# EAGLE design M060A (EAGLE 6.6.0)
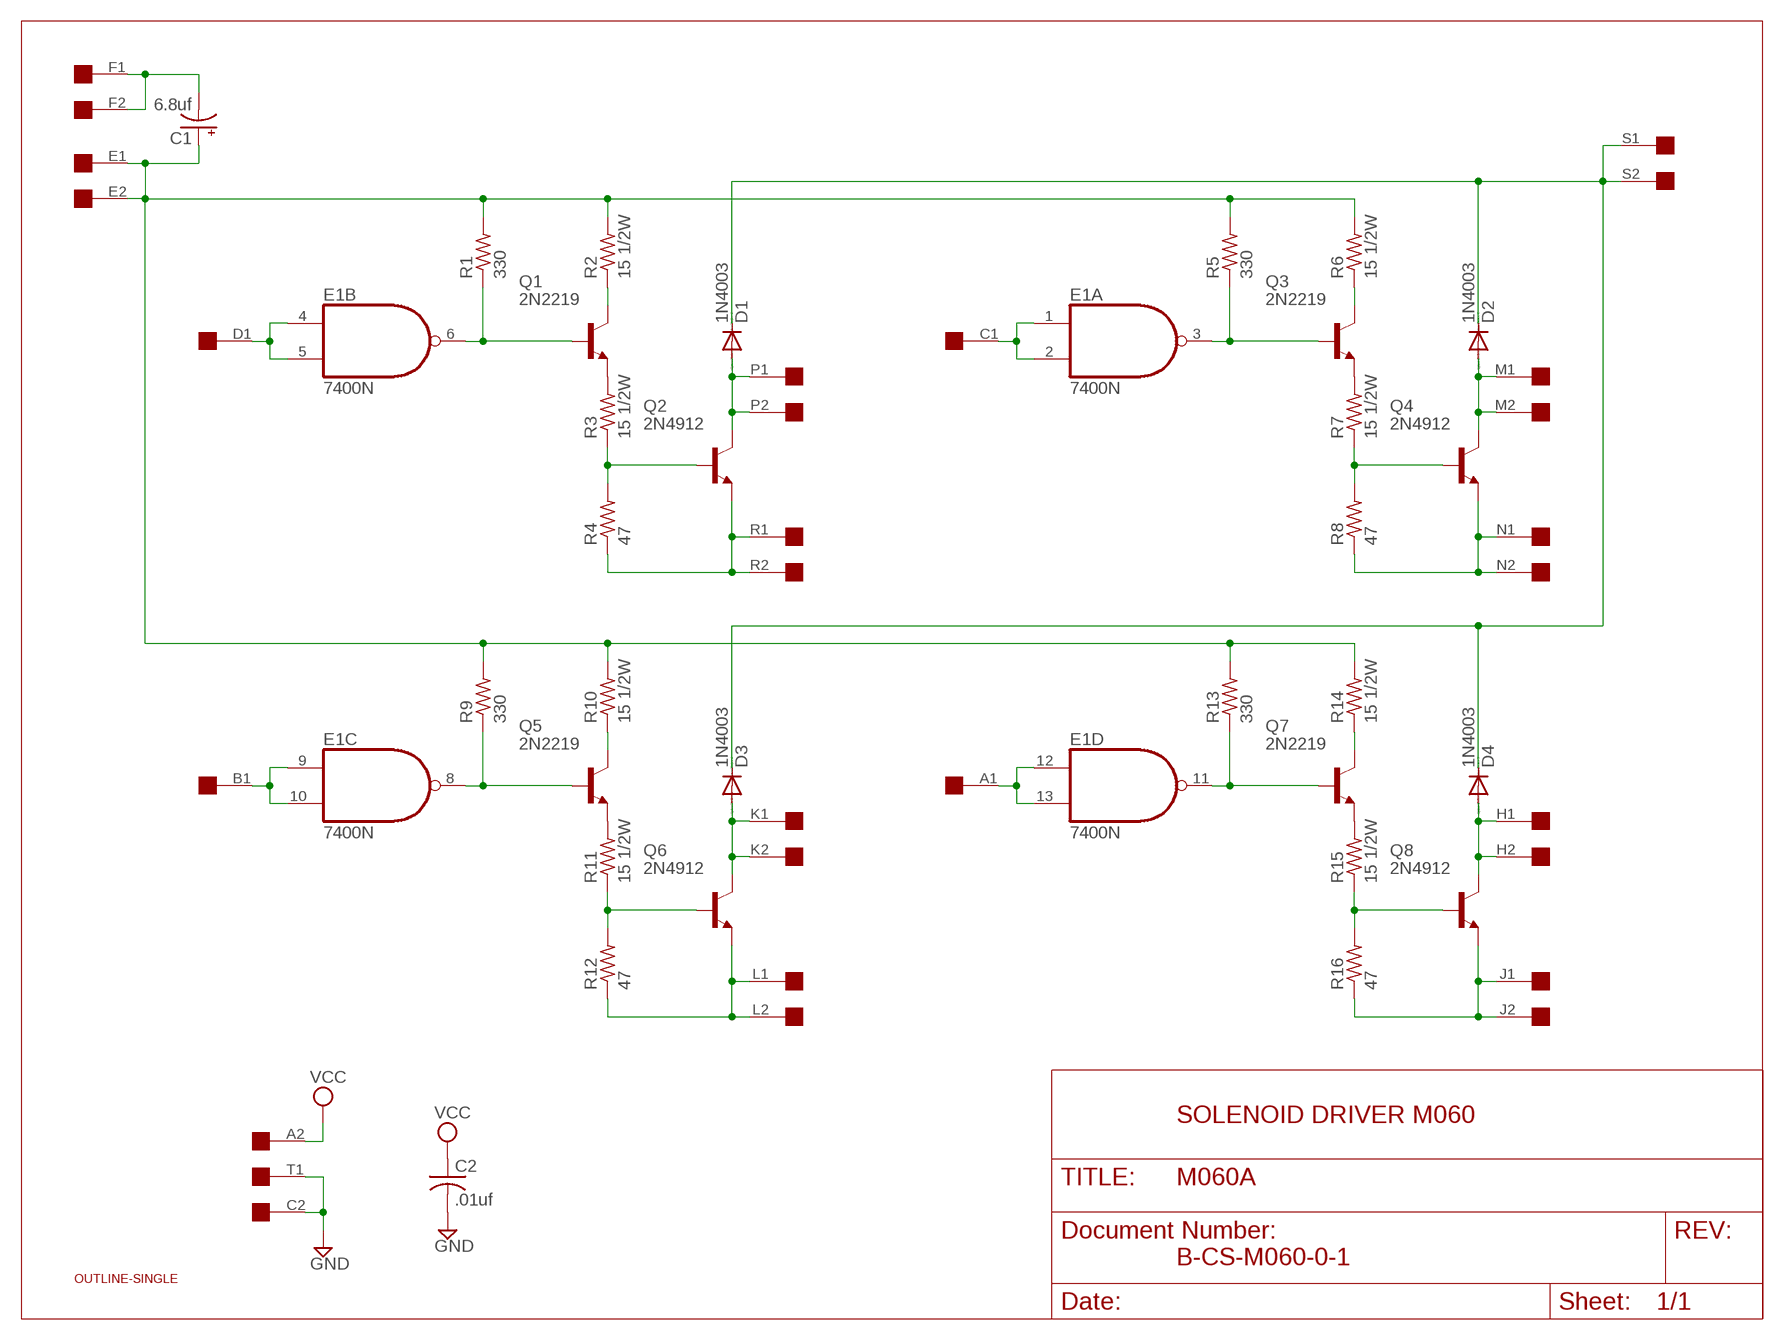
[diagram p0: schematic, sheet 1]

## Parts
C1  6.8uf  CPOL-USE15-5AXIAL  [E15-5]
C2  .01uf  C-US050-025X075  [C050-025X075]
D1  1N4003  1N4004  [DO41-10]
D2  1N4003  1N4004  [DO41-10]
D3  1N4003  1N4004  [DO41-10]
D4  1N4003  1N4004  [DO41-10]
E1  7400N  [DIL14]
Q1  2N2219  [TO5]
Q2  2N4912  -NPN-TO66  [TO66]
Q3  2N2219  [TO5]
Q4  2N4912  -NPN-TO66  [TO66]
Q5  2N2219  [TO5]
Q6  2N4912  -NPN-TO66  [TO66]
Q7  2N2219  [TO5]
Q8  2N4912  -NPN-TO66  [TO66]
R1  330  R-US_0207/10  [0207/10]
R2  15 1/2W  R-US_0411/15  [0411/15]
R3  15 1/2W  R-US_0411/15  [0411/15]
R4  47  R-US_0207/10  [0207/10]
R5  330  R-US_0207/10  [0207/10]
R6  15 1/2W  R-US_0411/15  [0411/15]
R7  15 1/2W  R-US_0411/15  [0411/15]
R8  47  R-US_0207/10  [0207/10]
R9  330  R-US_0207/10  [0207/10]
R10  15 1/2W  R-US_0411/15  [0411/15]
R11  15 1/2W  R-US_0411/15  [0411/15]
R12  47  R-US_0207/10  [0207/10]
R13  330  R-US_0207/10  [0207/10]
R14  15 1/2W  R-US_0411/15  [0411/15]
R15  15 1/2W  R-US_0411/15  [0411/15]
R16  47  R-US_0207/10  [0207/10]
U$1  SINGLE  [EDGE-CON2]
U$2  OUTLINE-SINGLE  [SINGLE]

## Nets
GND [Supply]: C2.2 U$1.C2 U$1.T1
N$1: E1.4(B:I0) E1.5(B:I1) U$1.D1
N$2: E1.6(B:O) Q1.2(B) R1.1
N$3 [Supply]: C1.+ R1.2 R2.2 R5.2 R6.2 R9.2 R10.2 R13.2 R14.2 U$1.E1 U$1.E2
N$4: Q1.3(C) R2.1
N$5: Q1.1(E) R3.2
N$6: Q2.2(B) R3.1 R4.2
N$7 [HighCurrent]: Q2.1(E) R4.1 U$1.R1 U$1.R2
N$8: D1.A Q2.3(C) U$1.P1 U$1.P2
N$9 [HighCurrent]: D1.C D2.C D3.C D4.C U$1.S1 U$1.S2
N$10: E1.1(A:I0) E1.2(A:I1) U$1.C1
N$11: E1.3(A:O) Q3.2(B) R5.1
N$12: Q3.3(C) R6.1
N$13: Q3.1(E) R7.2
N$14: Q4.2(B) R7.1 R8.2
N$15 [HighCurrent]: Q4.1(E) R8.1 U$1.N1 U$1.N2
N$16: D2.A Q4.3(C) U$1.M1 U$1.M2
N$17: E1.9(C:I0) E1.10(C:I1) U$1.B1
N$18: E1.8(C:O) Q5.2(B) R9.1
N$19 [Supply]: C1.- U$1.F1 U$1.F2
N$20: Q5.3(C) R10.1
N$21: Q5.1(E) R11.2
N$22: Q6.2(B) R11.1 R12.2
N$23 [HighCurrent]: Q6.1(E) R12.1 U$1.L1 U$1.L2
N$24 [HighCurrent]: D3.A Q6.3(C) U$1.K1 U$1.K2
N$25: E1.12(D:I0) E1.13(D:I1) U$1.A1
N$26: E1.11(D:O) Q7.2(B) R13.1
N$27: Q7.3(C) R14.1
N$28: Q7.1(E) R15.2
N$29: Q8.2(B) R15.1 R16.2
N$30 [HighCurrent]: Q8.1(E) R16.1 U$1.J1 U$1.J2
N$31 [HighCurrent]: D4.A Q8.3(C) U$1.H1 U$1.H2
VCC [Supply]: C2.1 U$1.A2
Unconnected: U$1.B2 U$1.D2 U$1.T2 U$1.U1 U$1.U2 U$1.V1 U$1.V2

## Notes on the sheet
- SOLENOID DRIVER M060
- B-CS-M060-0-1

## Power pins joined to a net without a drawn wire
GND: E1.7(P:GND)
VCC: E1.14(P:VCC)

## Library data of the parts
C1 = rcl:CPOL-US: POLARIZED CAPACITOR, American symbol
C2 = rcl:C-US: CAPACITOR, American symbol
D1-D4 = diode:1N4004: DIODE general purpose rectifier, 1 A
E1 = 74xx-us:74*00: Quad 2-input NAND gate
Q1 Q3 Q5 Q7 = transistor:2N2219: NPN TRANSISTOR
Q2 Q4 Q6 Q8 = transistor:*-NPN-: NPN Transistror BF959 corrected 2008.03.06
R1-R16 = rcl:R-US_: RESISTOR, American symbol
U$1 = dec-con:SINGLE: Single-Height DEC board
U$2 = dec-con:OUTLINE-*: Board outlines for DEC boards.

## Net classes
1 Supply: width 0.813 mm
2 HighCurrent: width 1.422 mm

## Board
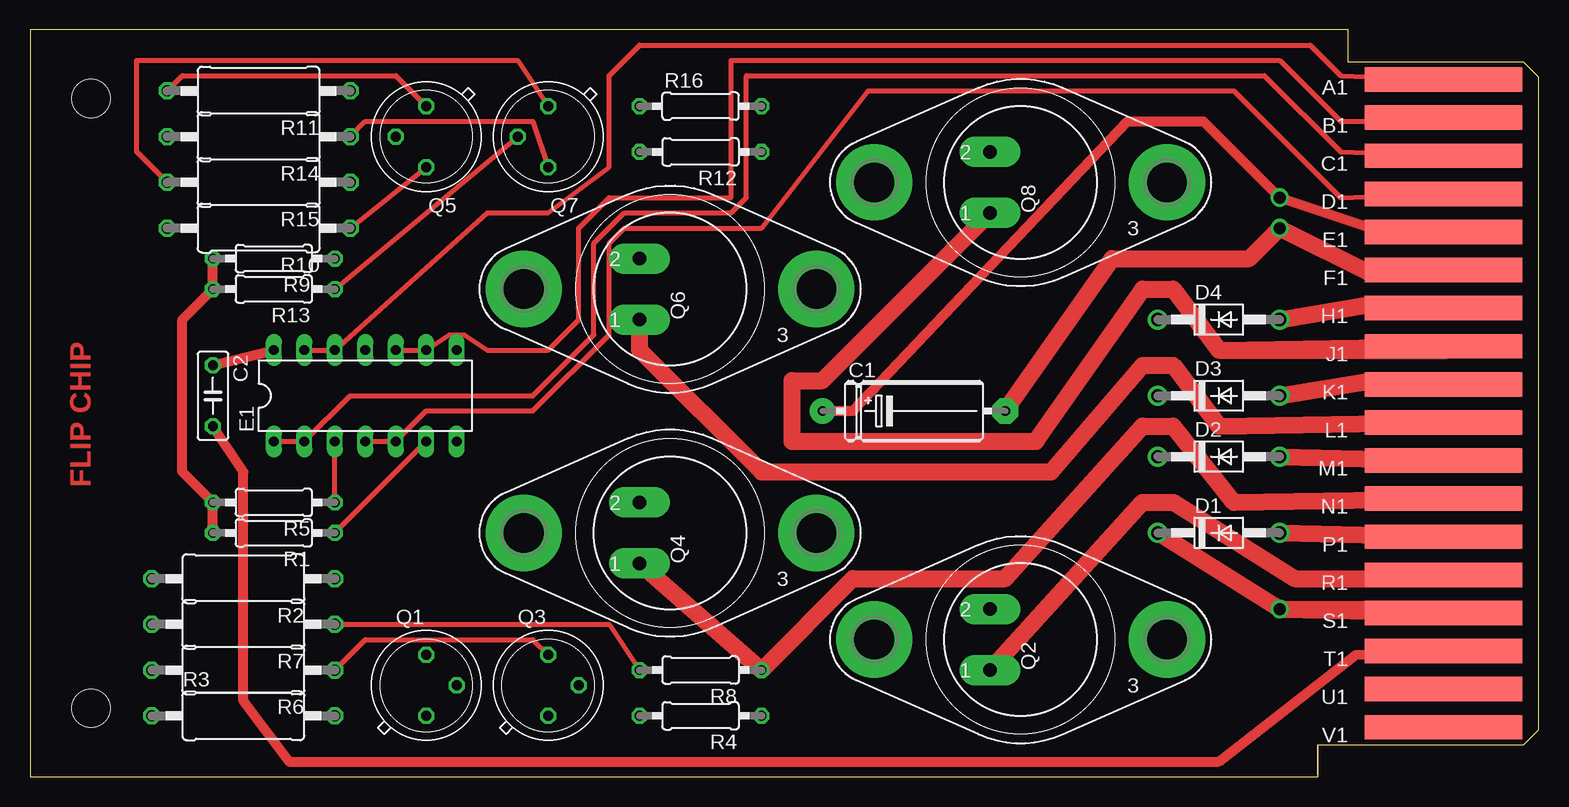
[diagram p1: board, top side]
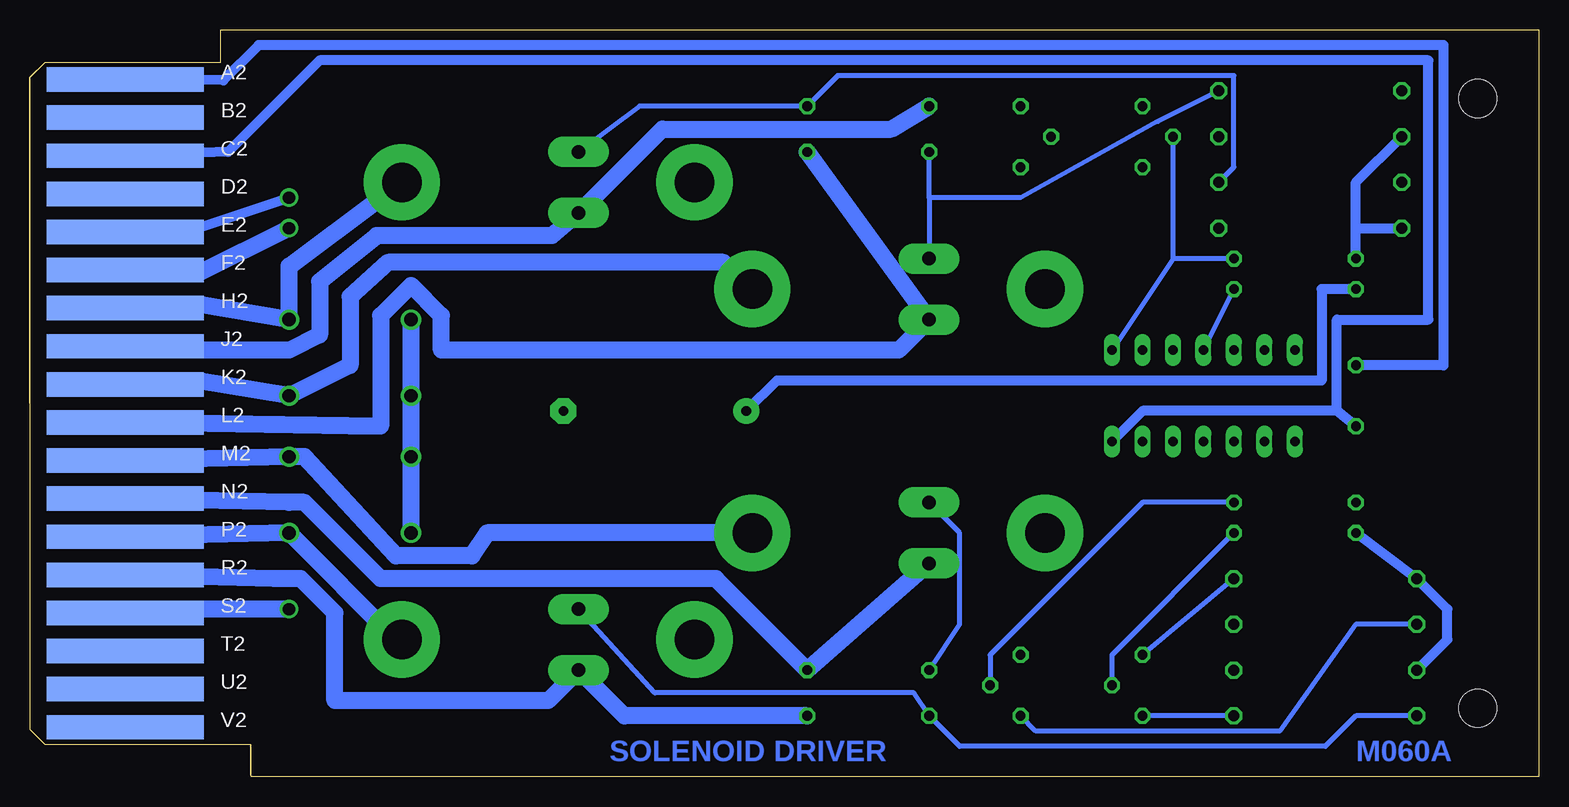
[diagram p2: board, bottom side, seen from below]

Size 125.73 x 62.23 mm. Coordinates in mm from the lower left corner, seen from the top.
Copper layers (1+16): Top 0.035mm / dielectric 1.5mm / Bottom 0.035mm
Design rules "16mils": minimum track width 16mil, minimum drill 32mil, track to track 15mil, track to pad 10mil, pad to pad 10mil, via to via 10mil, smd to smd 10mil, copper to edge 13mil, drill to drill 10mil, minimum pad ring 10mil, minimum via ring 8mil, stop-mask expansion 0mil, vias tented up to drill 0mil, thermal gap 10mil

### Footprints (pad centres in the part's own frame; a part is rotated, then mirrored left to right if it is on the bottom)
E15-5 = drill 0.813 pad 2.159: + -7.62,0 | drill 0.813 pad 2.159 octagon: - 7.62,0
C050-025X075 = drill 0.813 octagon: 1 -2.54,0; 2 2.54,0
DO41-10 = drill 1.118: A 5.08,0; C -5.08,0
DIL14 = drill 0.813 long: 1 -7.62,-3.81; 2 -5.08,-3.81; 3 -2.54,-3.81; 4 0,-3.81; 5 2.54,-3.81; 6 5.08,-3.81; 7 7.62,-3.81; 8 7.62,3.81; 9 5.08,3.81; 10 2.54,3.81; 11 0,3.81; 12 -2.54,3.81; 13 -5.08,3.81; 14 -7.62,3.81
TO5 = drill 0.813 octagon: 1 0,-2.54; 2 2.54,0; 3 0,2.54
TO66 = drill 1.118 pad 2.54 long: 1 -2.54,-2.54; 2 -2.54,2.54 | drill 3.302 pad 6.35: 3 12.192,0; TO66 -12.192,0
0207/10 = drill 0.813 octagon: 1 -5.08,0; 2 5.08,0
0411/15 = drill 0.914 octagon: 1 -7.62,0; 2 7.62,0
EDGE-CON2 = smd 13.106 x 2.032: A1 7.938,4.128; B1 7.938,7.303; C1 7.938,10.477; D1 7.938,13.652; E1 7.938,16.828; F1 7.938,20.003; H1 7.938,23.177; J1 7.938,26.352; K1 7.938,29.527; L1 7.938,32.703; M1 7.938,35.877; N1 7.938,39.053; P1 7.938,42.227; R1 7.938,45.403; S1 7.938,48.578; T1 7.938,51.752; U1 7.938,54.928; V1 7.938,58.102 | smd 13.106 x 2.032 bottom: A2 7.938,4.128; B2 7.938,7.303; C2 7.938,10.477; D2 7.938,13.652; E2 7.938,16.828; F2 7.938,20.003; H2 7.938,23.177; J2 7.938,26.352; K2 7.938,29.527; L2 7.938,32.703; M2 7.938,35.877; N2 7.938,39.053; P2 7.938,42.227; R2 7.938,45.403; S2 7.938,48.578; T2 7.938,51.752; U2 7.938,54.928; V2 7.938,58.102
SINGLE = hole 3.175: 120.65,56.515; 120.65,5.715

### Placement (x,y rotation side)
C1  73.66,30.48 0 top
C2  15.24,31.75 270 top
D1  99.06,20.32 0 top
D2  99.06,26.67 0 top
D3  99.06,31.75 0 top
D4  99.06,38.1 0 top
E1  27.94,31.75 0 top
Q1  33.02,7.62 0 top
Q2  82.55,11.43 0 top
Q3  43.18,7.62 0 top
Q4  53.34,20.32 0 top
Q5  33.02,53.34 180 top
Q6  53.34,40.64 0 top
Q7  43.18,53.34 180 top
Q8  82.55,49.53 0 top
R1  20.32,20.32 180 top
R2  17.78,16.51 180 top
R3  17.78,5.08 0 top
R4  55.88,5.08 180 top
R5  20.32,22.86 180 top
R6  17.78,8.89 180 top
R7  17.78,12.7 180 top
R8  55.88,8.89 180 top
R9  20.32,43.18 180 top
R10  19.05,45.72 180 top
R11  19.05,57.15 180 top
R12  55.88,52.07 180 top
R13  20.32,40.64 180 top
R14  19.05,53.34 180 top
R15  19.05,49.53 180 top
R16  55.88,55.88 0 top
U$1  125.73,62.23 180 top
U$2  125.73,62.23 180 top

### Tracks (layer width: path | path; a pad name or v marks a point on that pad's centre or on a via)
GND
  Top 0.813: U$1.T1 110.49,10.16 99.06,1.27 21.59,1.27 17.78,6.35 17.78,25.4 C2.2
  Bottom 0.813: U$1.C2 109.22,52.07 101.6,59.69 9.21,59.69 9.21,38.1 16.83,38.1 16.83,30.48 | C2.2 16.83,30.48 | 16.83,30.48 33.02,30.48 E1.7
N$1
  Top 0.406: E1.4 E1.5 33.02,30.48 41.91,30.48 48.26,36.83 48.26,44.45 49.53,45.72 60.96,45.72 69.85,57.15 100.33,57.15 109.22,48.26 U$1.D1
N$2
  Top 0.406: R1.1 E1.6
  Bottom 0.406: R1.1 35.56,10.16 Q1.2
N$3  (via drill 1.02)
  Top 0.813: R1.2 R5.2 12.7,25.4 12.7,38.1 R13.2 R9.2 | C1.+ 68.58,30.48 91.44,54.61 97.79,54.61 v104.14,48.26 111.76,45.72 U$1.E2
  Bottom 0.813: R6.2 7.62,11.43 7.62,13.97 R2.2 R1.2 | R14.2 15.24,49.53 15.24,45.72 | R9.2 15.24,45.72 | 15.24,45.72 R10.2 | C1.+ 63.5,33.02 18.1,33.02 18.1,40.64 R13.2 | v104.14,48.26 111.76,45.72 U$1.E2
N$4
  Bottom 0.406: R2.1 Q1.3
N$5
  Bottom 0.406: R3.2 Q1.1
N$6
  Bottom 0.406: Q2.2 73.66,6.99 52.07,6.99 R4.2 48.26,2.54 17.78,2.54 15.24,5.08 R3.1
N$7
  Top 1.422: U$1.R1 111.76,16.51 105.41,16.51 95.25,22.86 92.71,22.86 Q2.1
  Bottom 1.422: R4.1 76.2,5.08 Q2.1 82.55,6.35 100.33,6.35 100.33,13.65 103.19,16.51 105.41,16.51 U$1.R1
N$8
  Top 1.422: D1.A U$1.P2
  Bottom 1.422: U$1.P2 D1.A 95.25,11.43 Q2.3
N$9  (via drill 1.02)
  Top 1.422: 118.09,13.66 111.76,13.97 v104.14,13.97 | D1.C v104.14,13.97 | v104.14,13.97 U$1.S2
  Bottom 1.422: D4.C D3.C D2.C D1.C | v104.14,13.97 111.76,13.97 U$1.S2
N$10
  Top 0.406: E1.1 E1.2 26.67,31.75 41.91,31.75 46.99,36.83 46.99,44.45 49.53,46.99 58.42,46.99 59.69,48.26 59.69,58.42 102.87,58.42 109.22,52.07 U$1.C1
N$11
  Top 0.406: R5.1 E1.3
  Bottom 0.406: R5.1 33.02,22.86 45.72,10.16 Q3.2
N$12
  Top 0.406: R6.1 27.94,11.43 41.91,11.43 Q3.3
N$13
  Bottom 0.406: R7.2 15.24,12.7 21.59,3.81 41.91,3.81 Q3.1
N$14
  Top 0.406: R7.1 48.26,12.7 R8.2
  Bottom 0.406: R8.2 48.26,12.7 48.26,20.32 Q4.2
N$15
  Top 1.422: U$1.N1 100.33,22.86 95.25,29.21 92.71,29.21 81.28,16.51 68.58,16.51 R8.1 Q4.1
  Bottom 1.422: Q4.1 R8.1 68.58,16.51 96.52,16.51 102.87,22.86 104.14,22.86 U$1.N1
N$16
  Top 1.422: D2.A U$1.M2 D2.A
  Bottom 1.422: U$1.M2 D2.A 102.87,26.67 95.25,18.41 88.9,18.41 87.63,20.32 Q4.3
N$17
  Top 0.406: U$1.B1 111.76,54.61 109.22,54.61 104.14,59.69 58.42,59.69 58.42,48.26 48.26,48.26 45.72,45.72 45.72,38.1 43.18,35.56 38.1,35.56 36.2,36.83 34.92,36.83 E1.9 E1.10
N$18
  Bottom 0.406: 30.48,43.18 E1.8 | 30.48,43.18 Q5.2 | R9.1 30.48,43.18
N$19  (via drill 1.02)
  Top 1.422: U$1.F2 118.11,41.91 111.76,41.91 v104.14,45.72 101.6,43.18 90.17,43.18 C1.-
  Bottom 1.422: v104.14,45.72 111.76,41.91 U$1.F2
N$20
  Top 0.406: R10.1 Q5.3
N$21
  Top 0.406: R11.2 12.7,58.42 30.48,58.42 Q5.1
N$22
  Bottom 0.406: 50.8,48.26 Q6.2 | 50.8,48.26 R12.2 | R11.1 31.75,54.61 43.18,48.26 50.8,48.26
N$23
  Top 1.422: U$1.L1 99.06,29.21 95.25,34.29 92.71,34.29 85.09,25.4 60.96,25.4 50.8,35.56 Q6.1
  Bottom 1.422: R12.1 Q6.1 53.34,35.56 91.44,35.56 91.44,38.42 93.98,40.96 96.52,38.42 96.52,29.21 | 96.52,29.21 99.06,29.21 118.11,29.53 | 96.52,29.21 U$1.L1
N$24
  Top 1.422: D3.A 111.76,33.02 U$1.K2
  Bottom 1.422: U$1.K2 111.76,33.02 D3.A 99.06,34.29 99.06,40.01 95.89,42.86 67.94,42.86 Q6.3
N$25
  Top 0.406: E1.13 E1.12 38.1,46.99 43.18,46.99 48.26,50.8 48.26,58.42 50.8,60.96 106.68,60.96 109.22,58.42 U$1.A1
N$26
  Top 0.406: R13.1 Q7.2
  Bottom 0.406: E1.11 R13.1
N$27
  Top 0.406: R14.1 27.94,54.61 41.91,54.61 Q7.3
N$28
  Top 0.406: Q7.1 40.64,59.69 8.89,59.69 8.89,52.07 R15.2
N$29
  Bottom 0.406: R15.1 25.4,50.8 25.4,58.42 58.42,58.42 R16.2 74.93,55.88 Q8.2
N$30
  Top 1.422: Q8.1 66.04,33.02 63.5,33.02 63.5,27.94 83.82,27.94 92.71,40.64 95.25,40.64 99.06,35.56 | 99.06,35.56 118.11,35.56 | 99.06,35.56 U$1.J1
  Bottom 1.422: R16.1 53.98,53.98 73.03,53.98 Q8.1 82.23,45.09 96.84,45.09 101.6,41.27 101.6,36.83 104.14,35.56 111.76,35.56 U$1.J1
N$31
  Top 1.422: D4.A 111.76,39.37 U$1.H2
  Bottom 1.422: Q8.3 96.52,48.26 104.14,42.55 D4.A 111.76,39.37 U$1.H2
VCC
  Top 0.813: C2.1 E1.14
  Bottom 0.813: U$1.A2 109.62,58.02 106.68,60.96 7.94,60.96 7.94,34.29 C2.1

### Text on the board
Top: FLIP CHIP
Bottom: M060A | SOLENOID DRIVER